# EAGLE design Sensor (EAGLE 6.3)
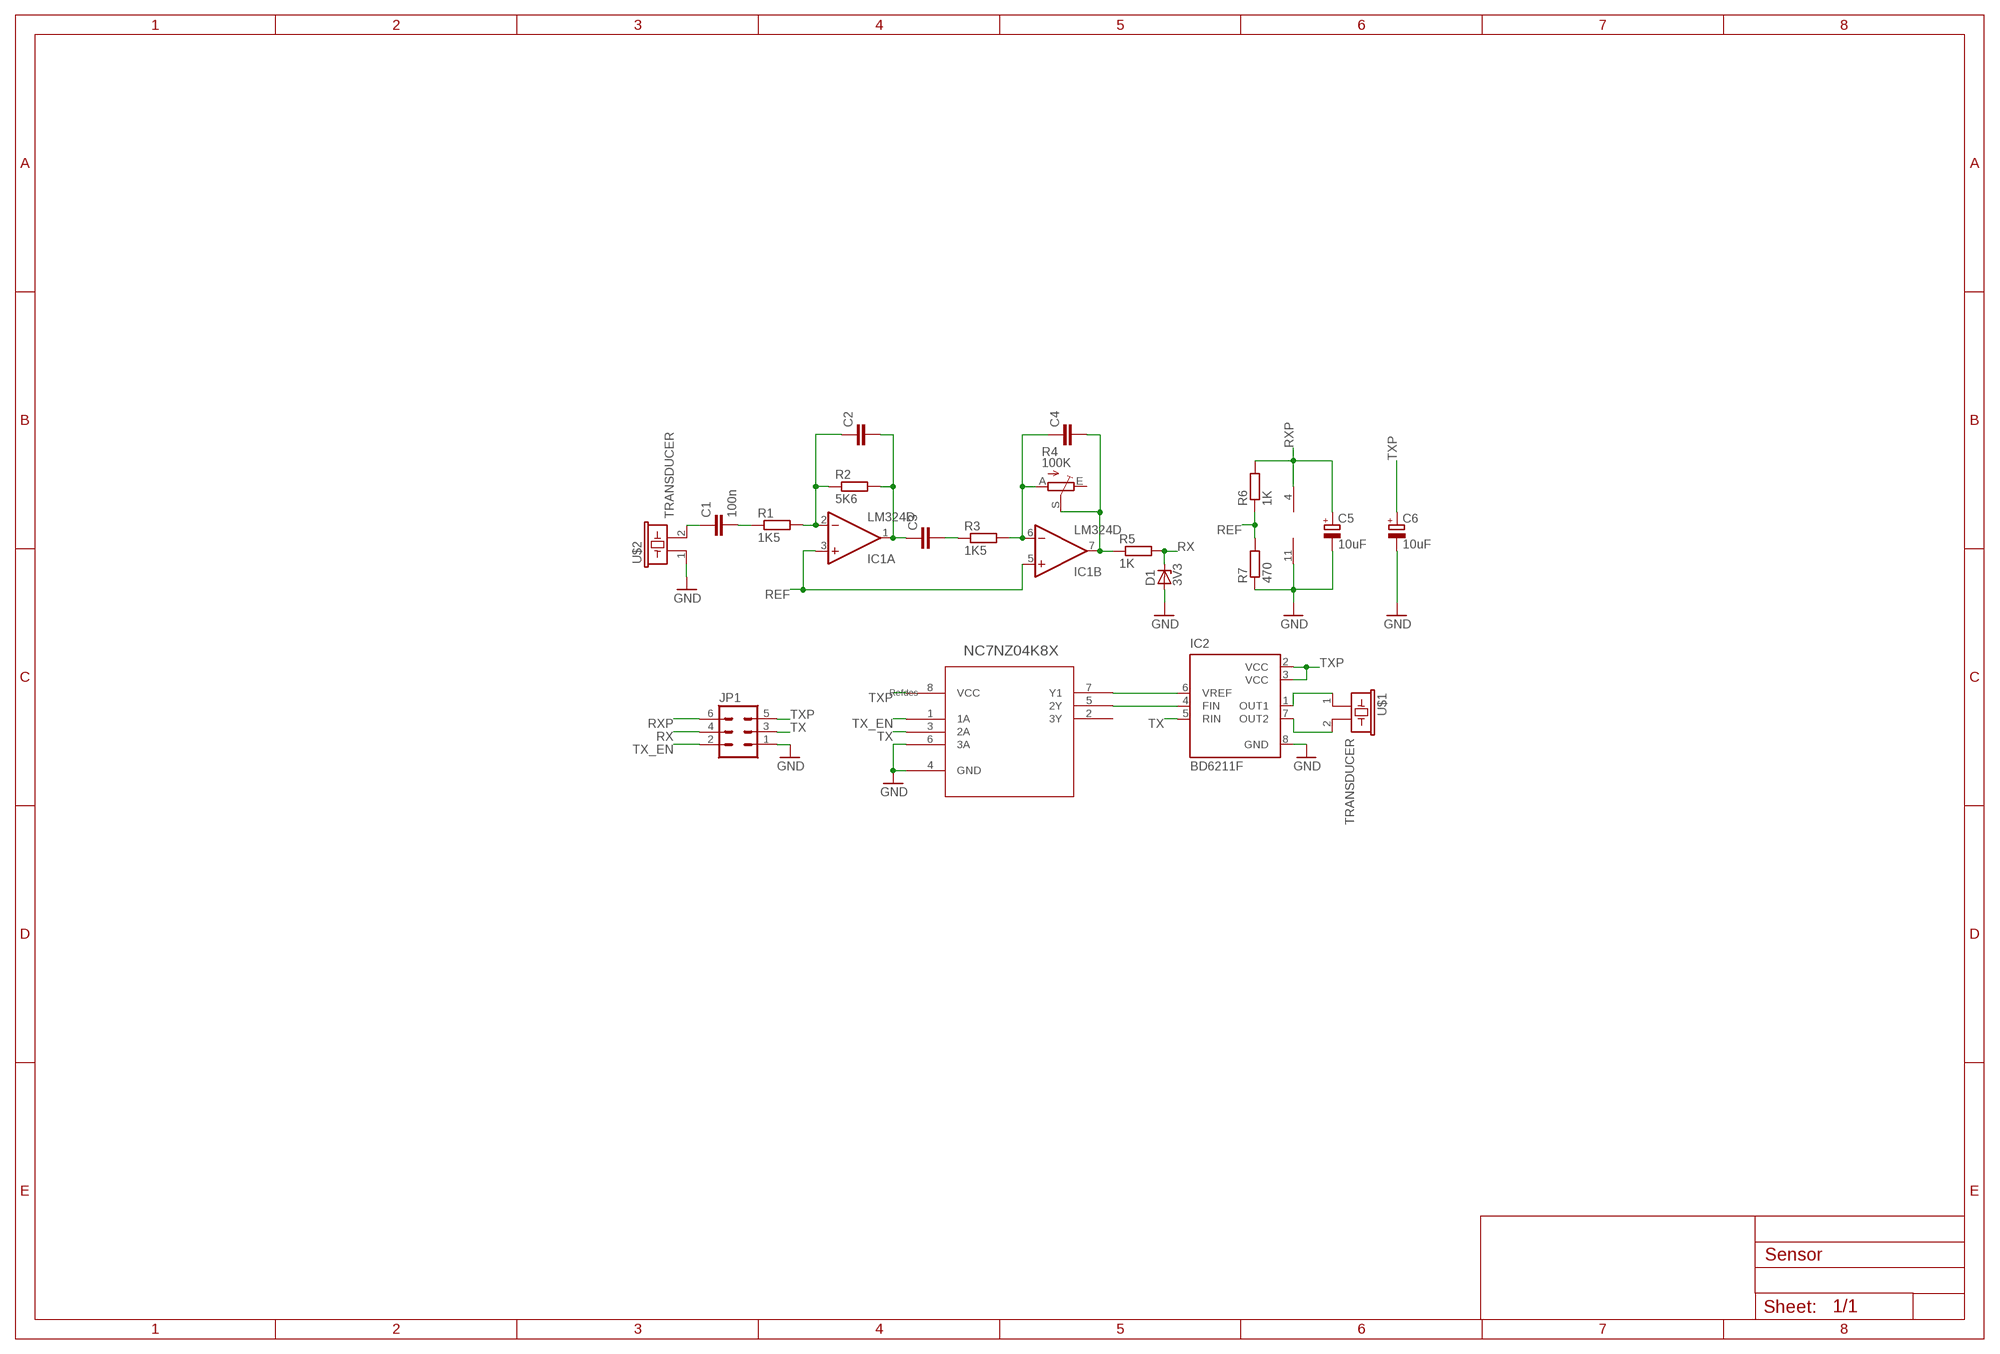
[diagram p0: schematic, sheet 1]

## Parts
C1  100n  C-EUC0805  [C0805]
C2  C-EUC0805  [C0805]
C3  C-EUC0805  [C0805]
C4  C-EUC0805  [C0805]
C5  10uF  CPOL-EUE2-5  [E2-5]
C6  10uF  CPOL-EUE2-5  [E2-5]
D1  3V3  ZENER-DIODEZD-2.5  [ZDIO-2.5]
IC1  LM324D  [SO14]
IC2  BD6211F  [SOP8]
JP1  MA03-2  [MA03-2]
R1  1K5  R-EU_R0805  [R0805]
R2  5K6  R-EU_R0805  [R0805]
R3  1K5  R-EU_R0805  [R0805]
R4  100K  TRIM_EU-S63P  [S63P]
R5  1K  R-EU_R0805  [R0805]
R6  1K  R-EU_R0805  [R0805]
R7  470  R-EU_R0805  [R0805]
U1  NC7NZ04K8X  [SOP50P310X90-8N]
U$1  TRANSDUCER  [TRANSDUCER]
U$2  TRANSDUCER  [TRANSDUCER]

## Nets
GND: C5.- C6.- D1.A IC1.11(P:V-) IC2.8(GND) JP1.1 R7.1 U1.4(GND) U1.6(3A) U$2.1
N$1: C2.1 IC1.2(A:-IN) R1.2 R2.1
N$2: C1.2 R1.1
N$3: C2.2 C3.1 IC1.1(A:OUT) R2.2
N$5: C3.2 R3.1
N$6: C4.1 IC1.6(B:-IN) R3.2 R4.A
N$7: C4.2 IC1.7(B:OUT) R4.S R5.1
N$9: C1.1 U$2.2
N$10: IC2.1(OUT1) U$1.1
N$11: IC2.7(OUT2) U$1.2
N$12: IC2.6(VREF) U1.7(Y1)
N$13: IC2.4(FIN) U1.5(2Y)
REF: IC1.3(A:+IN) IC1.5(B:+IN) R6.1 R7.2
RX: D1.C JP1.4 R5.2
RXP: C5.+ IC1.4(P:V+) JP1.6 R6.2
TX: IC2.5(RIN) JP1.3 U1.3(2A)
TX_EN: JP1.2 U1.1(1A)
TXP: C6.+ IC2.2(VCC) IC2.3(VCC) JP1.5 U1.8(VCC)
Unconnected: IC1.8(C:OUT) IC1.9(C:-IN) IC1.10(C:+IN) IC1.12(D:+IN) IC1.13(D:-IN) IC1.14(D:OUT) R4.E U1.2(3Y)

## Library data of the parts
C1-C4 = rcl:C-EU: CAPACITOR, European symbol
C5 C6 = rcl:CPOL-EU: POLARIZED CAPACITOR, European symbol
D1 = diode:ZENER-DIODE: Z-Diode
IC1 = linear:LM324: OP AMP; OC_FARNELL: 1426353
IC2 = Ultrasound:BD6211F; OC_FARNELL: 1716259
JP1 = con-lstb:MA03-2: PIN HEADER; OC_FARNELL: unknown; OC_NEWARK: unknown
R1-R3 R5-R7 = rcl:R-EU_: RESISTOR, European symbol
R4 = pot:TRIM_EU-: POTENTIOMETER
U1 = Ultrasound:NC7NZ04K8X: UHS Inverter; MPN: NC7NZ04K8X; OC_FARNELL: 1417663; OC_NEWARK: 33K4450; PACKAGE: SO-8; SUPPLIER: FAIRCHILD SEMICONDUCTOR
U$1 U$2 = Ultrasound:TRANSDUCER

## Board
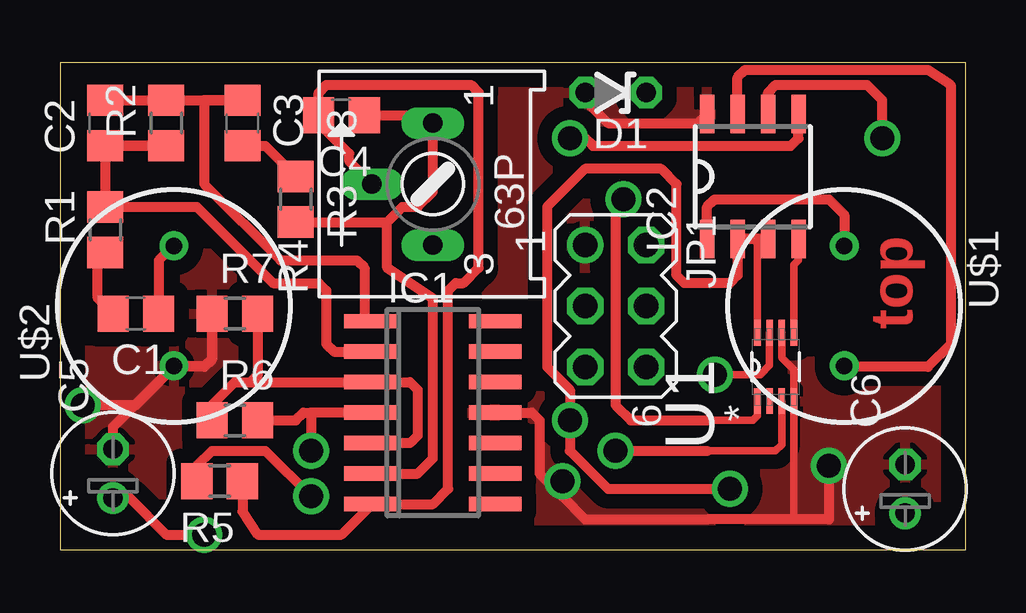
[diagram p1: board, top side]
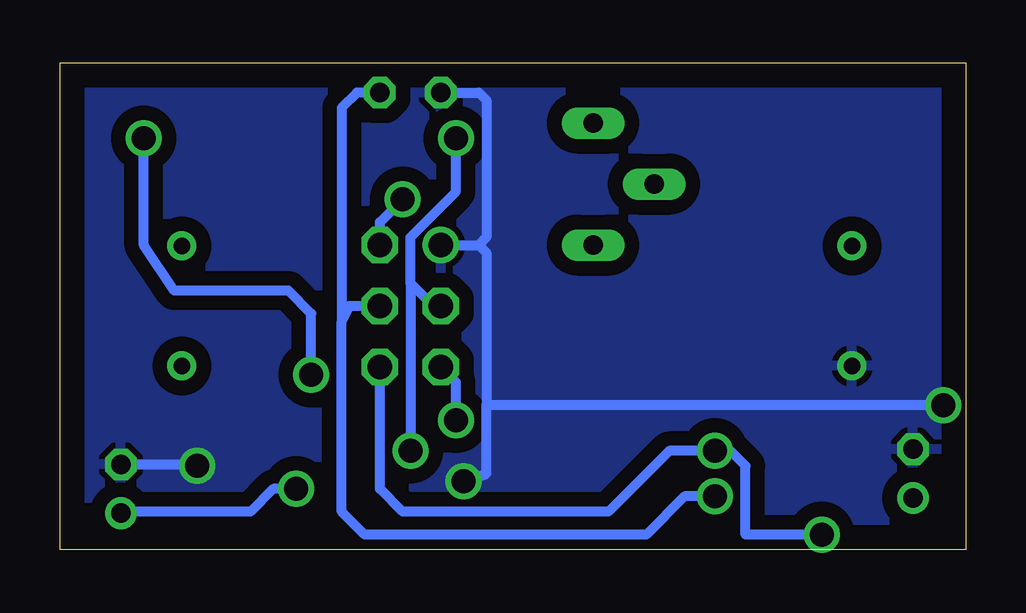
[diagram p2: board, bottom side, seen from below]

Size 37.77 x 20.3 mm. Coordinates in mm from the lower left corner, seen from the top.
Outline: 37.77,0 37.77,20.3 0,20.3 0,0 37.77,0
Copper layers (1*16): Top 0.035mm / dielectric 1.5mm / Bottom 0.035mm
Design rules "default": minimum track width 10mil, minimum drill 24mil, track to track 8mil, track to pad 8mil, pad to pad 8mil, via to via 8mil, smd to smd 8mil, copper to edge 40mil, drill to drill 8mil, minimum pad ring 10mil, minimum via ring 8mil, stop-mask expansion 4mil, vias tented up to drill 0mil, thermal gap 10mil

### Footprints (pad centres in the part's own frame; a part is rotated, then mirrored left to right if it is on the bottom)
C0805 = smd 1.3 x 1.5: 1 -0.95,0; 2 0.95,0
E2-5 = drill 0.813 pad 1.27: + -1.016,0 | drill 0.813 pad 1.27 octagon: - 1.016,0
ZDIO-2.5 = drill 0.813 octagon: A 1.27,0; C -1.27,0
SO14 = smd 0.6 x 2.2: 1 -3.81,-2.6; 2 -2.54,-2.6; 3 -1.27,-2.6; 4 0,-2.6; 5 1.27,-2.6; 6 2.54,-2.6; 7 3.81,-2.6; 8 3.81,2.6; 9 2.54,2.6; 10 1.27,2.6; 11 0,2.6; 12 -1.27,2.6; 13 -2.54,2.6; 14 -3.81,2.6
SOP8 = smd 0.6 x 1.6: 1 -1.905,-2.6; 2 -0.635,-2.6; 3 0.635,-2.6; 4 1.905,-2.6; 5 1.905,2.6; 6 0.635,2.6; 7 -0.635,2.6; 8 -1.905,2.6
MA03-2 = drill 1.016: 1 -2.54,-1.27 | drill 1.016 octagon: 2 -2.54,1.27; 3 0,-1.27; 4 0,1.27; 5 2.54,-1.27; 6 2.54,1.27
R0805 = smd 1.3 x 1.5: 1 -0.95,0; 2 0.95,0
S63P = drill 0.813 long: A 2.54,0; E -2.54,0; S 0,2.54
SOP50P310X90-8N = smd 1.067 x 0.279: 1 -1.422,0.762; 2 -1.422,0.254; 3 -1.422,-0.254; 4 -1.422,-0.762; 5 1.422,-0.762; 6 1.422,-0.254; 7 1.422,0.254; 8 1.422,0.762
TRANSDUCER = drill 0.7: 1 -2.5,0; 2 2.5,0

### Placement (x,y rotation side)
C1  3.16,9.84 180 top
C2  1.89,17.78 90 top
C3  7.61,17.78 270 top
C4  11.73,18.1 180 top
C5  2.21,3.17 90 top
C6  35.23,2.54 90 top
D1  23.17,19.05 180 top
IC1  15.54,5.71 270 top
IC2  28.88,15.56 0 top
JP1  23.17,10.16 270 top
R1  1.89,13.34 90 top
R2  4.43,17.78 90 top
R3  9.83,14.61 270 top
R4  15.54,15.24 90 top
R5  6.66,2.86 180 top
R6  7.29,5.4 0 top
R7  7.29,9.84 0 top
U1  29.83,7.62 90 top
U$1  32.69,10.16 270 top
U$2  4.75,10.16 90 top

### Tracks (layer width: path | path; a pad name or v marks a point on that pad's centre or on a via)
GND  (via drill 1 pad 1.27)
  Top 0.305: 26.98,1.27 30.47,1.27 30.59,1.4 U1.4 30.59,7.49 30.09,8 U1.6
  Top 0.406: C5.- 2.21,5.12 U$2.1 6.06,7.66 6.34,7.94 R7.1 6.34,7.94 6.02,7.62 4.75,7.62 3.16,6.03 v0.94,6.03 | IC1.11 19.67,5.71 19.99,5.4 19.99,3.17 20.31,2.86 v20.94,2.86 20.94,2.22 21.9,1.27 26.98,1.27 32.05,1.27 v32.05,3.49 | D1.A 21.9,18.73 22.85,17.78 26.6,17.78 IC2.8
  Bottom 0.406: v0.94,6.03 19.99,6.03 | v20.94,2.86 19.99,3.17 19.99,6.03 | JP1.1 20.31,12.7 | 20.31,12.7 19.99,12.38 19.99,6.03 | D1.A 20.31,19.05 19.99,18.73 19.99,13.02 20.31,12.7 | C6.- 32.12,3.56 v32.05,3.49
  pour Top (isolate 0.61): -0.97,20.32 37.77,20.32 37.77,0 -1.28,0 -1.28,20.32
  pour Bottom (isolate 0.61): -2.23,20.32 37.77,20.32 37.77,0 -2.23,0
N$1
  Top 0.406: R1.2 | C2.1 R2.1 C2.1 | C2.1 R1.2 | R1.2 5.7,14.29 8.88,11.11 10.78,11.11 11.1,10.79 11.1,8.57 11.42,8.26 IC1.2
N$2
  Top 0.406: C1.2 1.57,10.48 1.57,12.07 R1.1
N$3
  Top 0.406: C2.2 R2.2 C3.1 6.02,18.73 6.02,15.24 9.2,12.06 12.37,12.06 12.69,11.75 12.69,9.78 IC1.1
N$5
  Top 0.406: C3.2 8.55,16.83 R3.1
N$6
  Top 0.406: 13.64,13.65 13.64,11.75 15.54,10.48 15.54,3.81 14.91,3.17 IC1.6 | 13.64,13.65 14.28,14.29 14.91,14.29 15.54,14.92 R4.A 15.23,18.1 C4.1 | R3.2 13.64,13.65
N$7
  Top 0.406: C4.2 10.79,17.78 | 10.79,17.78 12.05,16.51 12.05,16.19 R4.S | 10.79,17.78 10.78,17.78 10.78,19.05 11.1,19.37 17.13,19.37 17.45,19.05 17.45,11.75 16.82,11.11 16.5,11.11 16.18,10.79 16.18,2.54 15.54,1.91 IC1.7 12.95,1.84 11.73,0.64 8.24,0.64 7.61,1.59 R5.1
N$9
  Top 0.406: U$2.2 4.71,12.66 4.12,12.06 C1.1
N$10
  Top 0.406: IC2.1 26.98,14.29 27.29,14.61 32.05,14.61 32.69,13.97 U$1.1
N$11
  Top 0.406: IC2.7 28.25,19.68 28.56,20 36.18,20 37.14,19.37 37.14,8.57 36.18,7.62 32.73,7.62 U$1.2
N$12  (via drill 1 pad 1.27)
  Top 0.305: U1.7 29.58,7.68 29.2,7.3 v27.29,7.3
  Top 0.406: IC2.6 29.52,19.05 29.83,19.37 33.64,19.37 34.28,18.73 v34.28,17.14
  Bottom 0.406: v27.29,7.3 27.29,9.84 28.25,10.79 33.01,10.79 34.28,12.7 v34.28,17.14
N$13
  Top 0.305: U1.5 30.59,11.87 30.79,12.06 IC2.4
REF
  Top 0.406: R6.1 6.34,6.04 7.29,6.99 7.93,6.99 | 7.93,6.99 IC1.3 14.59,6.99 14.91,6.67 14.91,4.76 14.59,4.45 IC1.5 | R7.2 8.24,7.3 7.93,6.99
RX  (via drill 1 pad 1.27)
  Top 0.406: R5.2 5.71,3.5 6.34,4.13 8.56,4.13 v10.46,2.22
  Bottom 0.406: v10.46,2.22 11.73,2.22 13.32,0.64 25.07,0.64 26.02,1.59 26.02,9.53 | 26.02,9.53 25.71,10.16 JP1.4 | D1.C 25.39,19.05 26.02,18.41 26.02,9.53
RXP  (via drill 1 pad 1.27)
  Top 0.406: C5.+ 2.91,2.16 4.43,0.64 v6.02,0.64 | R6.2 9.83,5.4 10.15,5.71 10.46,5.71 | IC1.4 10.46,5.71 | 10.46,5.71 v10.46,4.13
  Bottom 0.406: v6.02,0.64 9.2,0.64 9.2,3.49 9.83,4.13 v10.46,4.13 12.37,4.13 14.91,1.59 23.48,1.59 24.44,2.54 JP1.6
TX  (via drill 1 pad 1.27)
  Top 0.305: U1.3 30.09,4.38 29.83,4.13 26.98,4.13
  Top 0.406: v21.26,17.14 21.9,17.14 22.21,16.83 30.47,16.83 30.79,17.14 IC2.5 | v23.17,4.13 26.98,4.13
  Bottom 0.406: 23.17,11.11 23.17,13.02 21.26,14.92 v21.26,17.14 | JP1.3 22.21,10.16 23.17,11.11 | 23.17,11.11 v23.17,4.13
TX_EN  (via drill 1 pad 1.27)
  Top 0.305: U1.1 29.07,5.59 28.88,5.4 26.98,5.4
  Top 0.406: v23.48,14.61 23.17,14.29 23.17,6.03 23.8,5.4 26.98,5.4
  Bottom 0.406: JP1.2 24.44,13.65 v23.48,14.61
TXP  (via drill 1 pad 1.27)
  Top 0.305: U1.8 29.07,12.77 28.88,12.96
  Top 0.406: v27.93,2.54 22.85,2.54 21.26,4.13 v21.26,5.4 21.26,6.67 20.31,7.62 20.31,14.29 21.9,15.88 25.07,15.88 25.71,15.24 25.71,11.43 26.02,11.11 27.93,11.11 28.25,11.43 28.25,13.02 28.31,12.96 IC2.3 28.88,12.96 IC2.2
  Bottom 0.406: v21.26,5.4 21.26,6.99 JP1.5 | v27.93,2.54 28.88,2.54 29.83,1.59 35.17,1.59 C6.+ 35.29,1.59

### Text on the board
Top: top